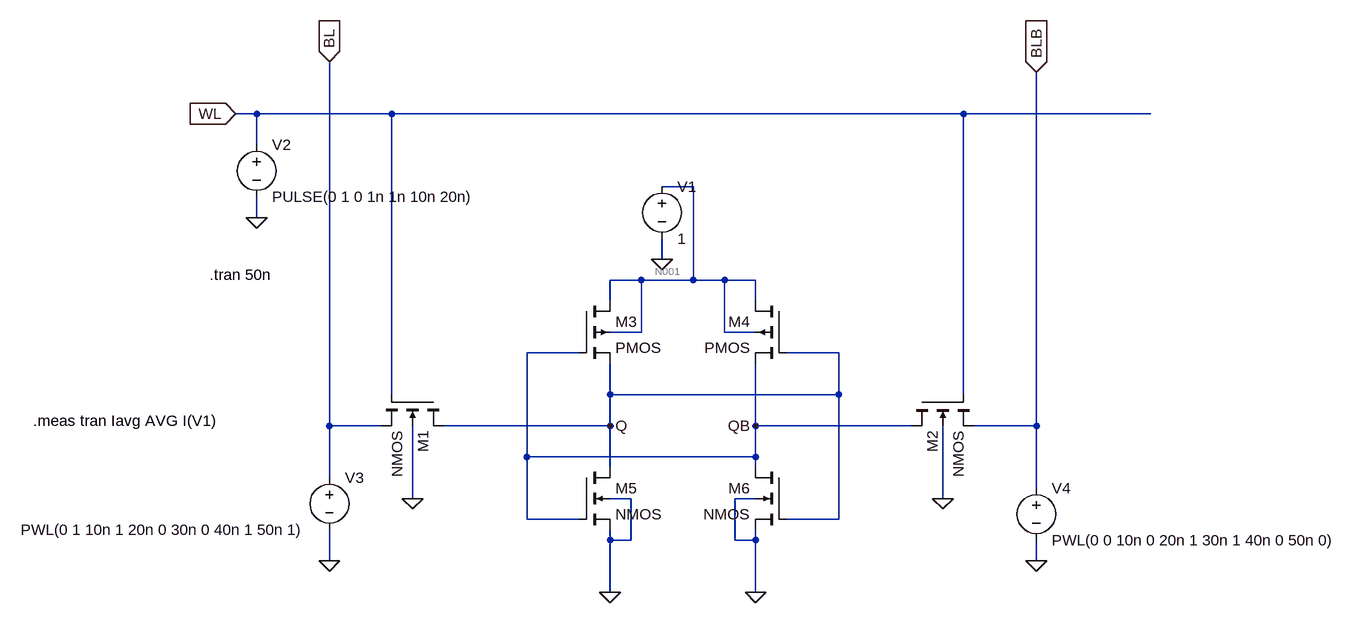
[diagram p0: schematic 6T SRAM.asc]
6T SRAM.asc, the LTspice schematic file:
Version 4.1
SHEET 1 1284 692
WIRE -416 -320 -448 -320
WIRE -208 -320 -416 -320
WIRE 672 -320 -208 -320
WIRE 960 -320 672 -320
WIRE -416 -272 -416 -320
WIRE 256 -208 208 -208
WIRE -416 -160 -416 -192
WIRE 208 -96 208 -128
WIRE 176 -64 128 -64
WIRE 256 -64 256 -208
WIRE 256 -64 176 -64
WIRE 304 -64 256 -64
WIRE 352 -64 304 -64
WIRE 128 -32 128 -64
WIRE 352 -32 352 -64
WIRE 176 16 176 -64
WIRE 176 16 128 16
WIRE 304 16 304 -64
WIRE 352 16 304 16
WIRE 80 48 0 48
WIRE 480 48 400 48
WIRE -208 112 -208 -320
WIRE 128 112 128 64
WIRE 480 112 480 48
WIRE 480 112 128 112
WIRE 672 112 672 -320
WIRE -304 160 -304 -400
WIRE -224 160 -304 160
WIRE 128 160 128 112
WIRE 128 160 -128 160
WIRE 352 160 352 64
WIRE 592 160 352 160
WIRE 784 160 784 -384
WIRE 784 160 688 160
WIRE 0 208 0 48
WIRE 352 208 352 160
WIRE 352 208 0 208
WIRE 128 224 128 160
WIRE 352 224 352 208
WIRE -304 240 -304 160
WIRE 784 256 784 160
WIRE -176 272 -176 160
WIRE 160 272 128 272
WIRE 352 272 320 272
WIRE 640 272 640 160
WIRE 0 304 0 208
WIRE 80 304 0 304
WIRE 480 304 480 112
WIRE 480 304 400 304
WIRE 128 336 128 320
WIRE 160 336 160 272
WIRE 160 336 128 336
WIRE 320 336 320 272
WIRE 352 336 352 320
WIRE 352 336 320 336
WIRE -304 368 -304 320
WIRE 784 368 784 336
WIRE 128 416 128 336
WIRE 352 416 352 336
FLAG 128 416 0
FLAG 352 416 0
FLAG 208 -96 0
FLAG -176 272 0
FLAG 640 272 0
FLAG -448 -320 WL
IOPIN -448 -320 In
FLAG -304 -400 BL
IOPIN -304 -400 In
FLAG 784 -384 BLB
IOPIN 784 -384 In
FLAG 128 160 Q
FLAG 352 160 QB
FLAG -304 368 0
FLAG 784 368 0
FLAG -416 -160 0
SYMBOL nmos4 -128 112 R90
SYMATTR InstName M1
SYMATTR Value2 l=180n w=1u
SYMBOL nmos4 592 112 M90
SYMATTR InstName M2
SYMATTR Value2 l=180n w=1u
SYMBOL pmos4 80 -32 R0
SYMATTR InstName M3
SYMATTR Value2 l=180n w=2u
SYMBOL pmos4 400 -32 M0
SYMATTR InstName M4
SYMATTR Value2 l=180n w=2u
SYMBOL nmos4 80 224 R0
SYMATTR InstName M5
SYMATTR Value2 l=180n w=1u
SYMBOL nmos4 400 224 M0
SYMATTR InstName M6
SYMATTR Value2 l=180n w=1u
SYMBOL voltage 208 -224 R0
WINDOW 123 0 0 Left 0
WINDOW 39 0 0 Left 0
SYMATTR InstName V1
SYMATTR Value 1
SYMBOL voltage -416 -288 R0
WINDOW 123 0 0 Left 0
WINDOW 39 0 0 Left 0
SYMATTR InstName V2
SYMATTR Value PULSE(0 1 0 1n 1n 10n 20n)
SYMBOL voltage -304 224 R0
WINDOW 3 -475 96 Left 2
WINDOW 123 0 0 Left 0
WINDOW 39 0 0 Left 0
SYMATTR InstName V3
SYMATTR Value PWL(0 1 10n 1 20n 0 30n 0 40n 1 50n 1)
SYMBOL voltage 784 240 R0
WINDOW 123 0 0 Left 0
WINDOW 39 0 0 Left 0
SYMATTR InstName V4
SYMATTR Value PWL(0 0 10n 0 20n 1 30n 1 40n 0 50n 0)
TEXT -488 -72 Left 2 !.tran 50n
TEXT -760 152 Left 2 !.meas tran Iavg AVG I(V1)

The netlist it stands for:
* 6T SRAM.asc
M1 Q WL BL 0 NMOS l=180n w=1u
M2 QB WL BLB 0 NMOS l=180n w=1u
M3 N001 QB Q N001 PMOS l=180n w=2u
M4 N001 Q QB N001 PMOS l=180n w=2u
M5 Q QB 0 0 NMOS l=180n w=1u
M6 QB Q 0 0 NMOS l=180n w=1u
V1 N001 0 1
V2 WL 0 PULSE(0 1 0 1n 1n 10n 20n)
V3 BL 0 PWL(0 1 10n 1 20n 0 30n 0 40n 1 50n 1)
V4 BLB 0 PWL(0 0 10n 0 20n 1 30n 1 40n 0 50n 0)
.model NMOS NMOS
.model PMOS PMOS
.lib standard.mos
.tran 50n
.meas tran Iavg AVG I(V1)
.backanno
.end

* Results of the author's LTspice run, read from the files saved beside the schematic
* Operating Point, zero values left out:
*   V(bl) = 1 V
*   V(n001) = 1 V
*   V(q) = 585.8 mV
*   V(qb) = 585.8 mV
*   I(V1) = -38.13 µA
*   I(V3) = -1.424 pA
*   Ib(M1) = -1.606 pA
*   Id(M2) = 1.182 pA
*   Id(M3) = 19.06 µA
*   Id(M4) = 19.06 µA
*   Id(M5) = 19.06 µA
*   Id(M6) = 19.06 µA
*   Is(M1) = 1.424 pA
*   Is(M3) = -19.06 µA
*   Is(M4) = -19.06 µA
*   Is(M5) = -19.06 µA
*   Is(M6) = -19.06 µA
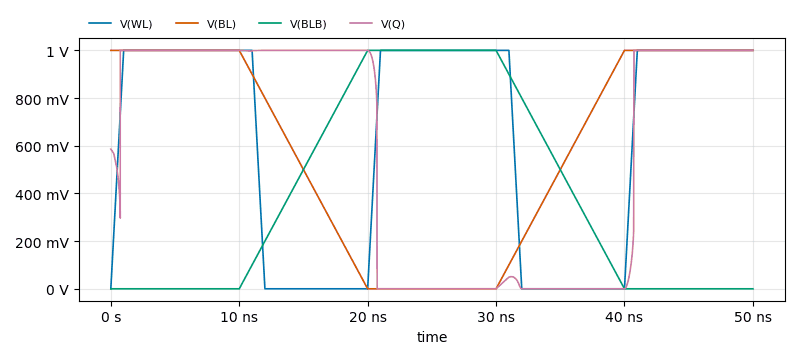
[diagram p1: Transient Analysis of 6T SRAM.asc, plotted from the saved traces]
* Transient Analysis, 1 run:
*   V(WL): min 0 V, max 1 V, average 630 mV, rms 783.3 mV, last 1 V
*   V(BL): min 0 V, max 1 V, average 600 mV, rms 753.3 mV, last 1 V
*   V(BLB): min 0 V, max 1 V, average 400 mV, rms 606.2 mV, last 0 V
*   V(Q): min 0 V, max 1 V, average 594.3 mV, rms 766.7 mV, last 1 V
* From the log:
*   iavg: AVG(I(V1))=-9.69105759863e-07 FROM 0 TO 5e-08